# Altium schematic sheet Cell monitoring and balancing.SchDoc
size A4; Organization: Altium Limited; Address1: L3, 12a Rodborough Rd; Address2: Frenchs Forest; Address3: NSW; Address4: Australia 2086; SheetNumber: 3; SheetTotal: 5
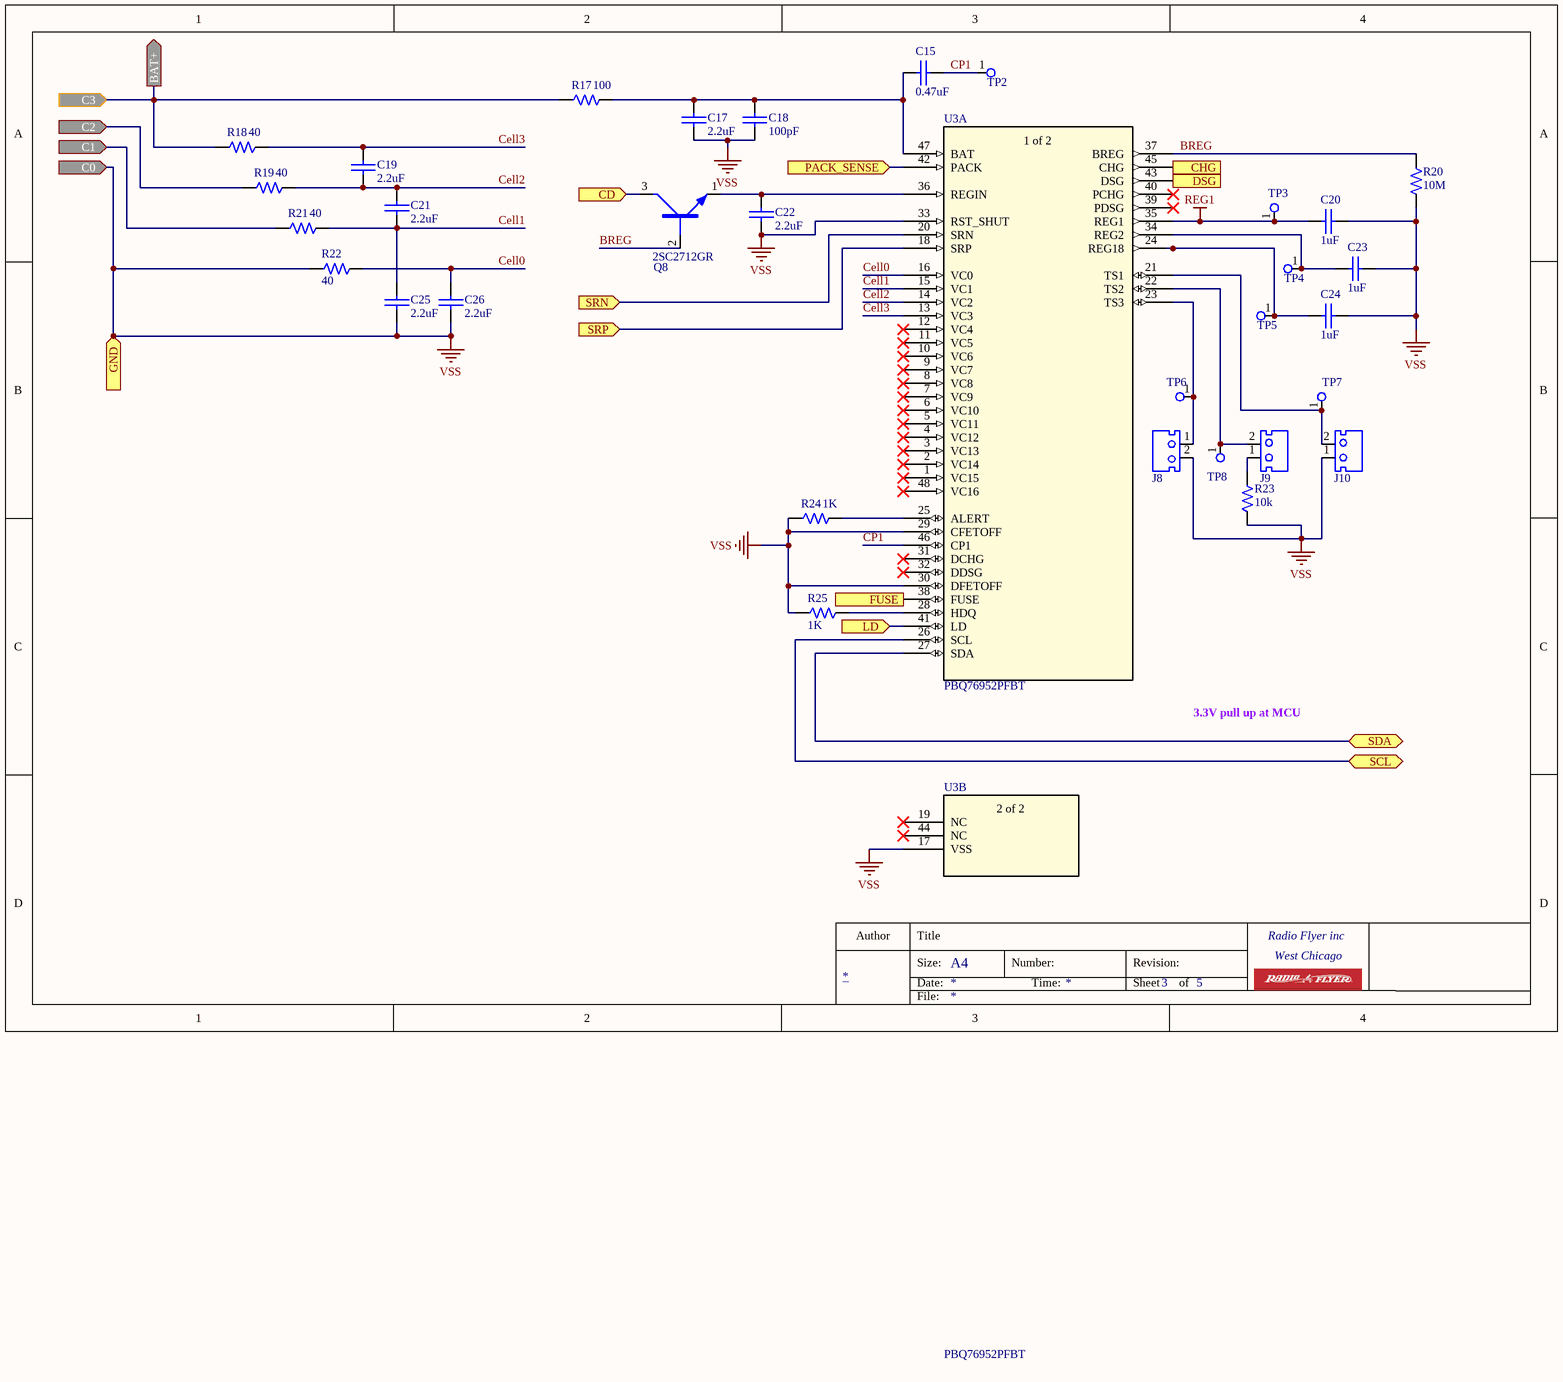
[diagram p0: Cell monitoring and balancing.SchDoc]

## Parts
C15  value 0.47uF  [CAPC0603-RW]  (hidden comment: T542021037308)
C17  value 2.2uF  [CAPC0603-RW]  (hidden comment: T542021037308)
C18  value 100pF  [CAPC0603-RW]  (hidden comment: T542021037308)
C19  value 2.2uF  [CAPC0603-RW]  (hidden comment: T542021037308)
C20  value 1uF  [CAPC0603-RW]  (hidden comment: T542021037308)
C21  value 2.2uF  [CAPC0603-RW]  (hidden comment: T542021037308)
C22  value 2.2uF  [CAPC0603-RW]  (hidden comment: T542021037308)
C23  value 1uF  [CAPC0603-RW]  (hidden comment: T542021037308)
C24  value 1uF  [CAPC0603-RW]  (hidden comment: T542021037308)
C25  value 2.2uF  [CAPC0603-RW]  (hidden comment: T542021037308)
C26  value 2.2uF  [CAPC0603-RW]  (hidden comment: T542021037308)
J8  CCN250002-0102  [CONN 2P PH=2.5mm HAA250A-2 RED]  (value not drawn)
J9  CCN250002-0102  [CONN 2P PH=2.5mm HAA250A-2 RED]  (value not drawn)
J10  CCN250002-0102  [CONN 2P PH=2.5mm HAA250A-2 RED]  (value not drawn)
Q8  T5810040804A0  [2SC2712GR]  (value not drawn)
R17  value 100  [0603-RW]  (hidden comment: T502976002399)
R18  value 40  [0603-RW]  (hidden comment: T502976002399)
R19  value 40  [0603-RW]  (hidden comment: T502976002399)
R20  value 10M  [0603-RW]  (hidden comment: T502976002399)
R21  value 40  [0603-RW]  (hidden comment: T502976002399)
R22  value 40  [0603-RW]  (hidden comment: T502976002399)
R23  value 10k  [0603-RW]  (hidden comment: T502976002399)
R24  value 1K  [0603-RW]  (hidden comment: T502976002399)
R25  value 1K  [0603-RW]  (hidden comment: T502976002399)
TP2  CP1  [RT-01T-1.0B]  (value not drawn)
TP3  CP1  [RT-01T-1.0B]  (value not drawn)
TP4  CP1  [RT-01T-1.0B]  (value not drawn)
TP5  CP1  [RT-01T-1.0B]  (value not drawn)
TP6  CP1  [RT-01T-1.0B]  (value not drawn)
TP7  CP1  [RT-01T-1.0B]  (value not drawn)
TP8  CP1  [RT-01T-1.0B]  (value not drawn)
U3  PBQ76952PFBT  [PFB48_TEX]  (parts A,B of 2)

## Ports
BAT+ (out), C0 (in), C1 (in), C2 (in), C3 (in), CD (in), CHG (out), DSG (out), FUSE (out), GND (in), LD (in), PACK_SENSE (in), SCL (bidir), SDA (bidir), SRN (in), SRP (in)

## Nets
REG1: C20.2 TP3.1 U3.35(REG1)
VSS: C17.1 C18.1 C20.1 C22.1 C23.1 C24.1 C25.1 C26.1 J8.2 J10.1 R20.2 R22.1 R23.2 R24.1 R25.1 U3.17(VSS) U3.29(CFETOFF) U3.30(DFETOFF) U3.33(RST_SHUT) ; port C0, port GND
BAT+: R17.1 R18.1 ; port BAT+, port C3
BREG: Q8.2(B) R20.1 U3.37(BREG)
C1: R21.1 ; port C1
C2: R19.1 ; port C2
CD: Q8.3(C) ; port CD
Cell0: C26.2 R22.2 U3.16(VC0)
Cell1: C21.1 C25.2 R21.2 U3.15(VC1)
Cell2: C19.1 C21.2 R19.2 U3.14(VC2)
Cell3: C19.2 R18.2 U3.13(VC3)
CHG: U3.45(CHG) ; port CHG
CP1: C15.1 TP2.1 U3.46(CP1)
DSG: U3.43(DSG) ; port DSG
FUSE: U3.38(FUSE) ; port FUSE
LD: U3.41(LD) ; port LD
PACK_SENSE: U3.42(PACK) ; port PACK_SENSE
SCL: U3.26(SCL) ; port SCL
SDA: U3.27(SDA) ; port SDA
SRN: U3.20(SRN) ; port SRN
SRP: U3.18(SRP) ; port SRP
NetC15_2: C15.2 C17.2 C18.2 R17.2 U3.47(BAT)
NetC22_2: C22.2 Q8.1(E) U3.36(REGIN)
NetC23_2: C23.2 TP4.1 U3.34(REG2)
NetC24_2: C24.2 TP5.1 U3.24(REG18)
NetJ8_1: J8.1 TP6.1 U3.23(TS3)
NetJ9_1: J9.1 R23.1
NetJ9_2: J9.2 TP8.1 U3.22(TS2)
NetJ10_2: J10.2 TP7.1 U3.21(TS1)
NetR24_2: R24.2 U3.25(ALERT)
NetR25_2: R25.2 U3.28(HDQ)

Not connected (* = marked no-connect by the designer): U3 1(VC15)* 2(VC14)* 3(VC13)* 4(VC12)* 5(VC11)* 6(VC10)* 7(VC9)* 8(VC8)* 9(VC7)* 10(VC6)* 11(VC5)* 12(VC4)* 19(NC)* 31(DCHG)* 32(DDSG)* 39(PDSG)* 40(PCHG)* 44(NC)* 48(VC16)*

## Notes on the sheet
- 3.3V pull up at MCU
- Author
- Title
- Size:
- Date:
- A4
- Number:
- Time:
- Revision:
- Sheet
- of
- Radio Flyer inc
- West Chicago
- File:
- (in symbol PBQ76952PFBT, part A) 1 of 2
- (in symbol PBQ76952PFBT, part B) 2 of 2

## Library data of the parts
C15 C17-C26 = CAP0603 0.01uF 16V 10%_X7R_WALSIN: CAP X7R .01UF 16V +-10% 0603 WALSIN L; Tolerance: 10%; Type: Capacitor; CREATE_NAME: Nathan; DIP&SMD: SMD; SAP: T542021037308; PACKAGE: CAPC0603; Vendor Name: *; MFG: WALSIN; MFG Part: *; Other: X7R; CREATE_TIME: 13-July-2016; Customer Specific: N/A; Voltage: 16V
J8-J10 = CONN 2P PH=2.5mm HAA250A-2 RED: CONNECTOR HA2.5 2PIN RED G; Value: 2.5mm; SAP: T690300024700; MFG: 金瑞康; CREATE_NAME: Nathan; Current: 3A; DIP&SMD: DIP; MFG Part: HAA250A-2 RED; Vendor Name: *; Vendor Code: *; Type: Connector; CREATE_TIME: 15-June-2016
Q8 = 2SC2712GR: NPN 50V 2SC2712GR SOT23 BLUE R K; MFG: BLUE ROCKET(藍箭電子); Current: 0.15A; CREATE_NAME: Nathan; DIP&SMD: SMD; SAP: T5810040804A0; Vendor Code: *; Vendor Name: *; Power: *; Voltage: 50V; Type: NPN; CREATE_TIME: 14-July-2017; Package: SOT23 (SC-59 SST3); Customer Specific: N/A; MFG Part: 2SC2712GR
R17-R25 = RES0603 1/10W +-1% 976 OHM 100PPM: CHIP 976 OHM 100PPM +-1% 0603 WALS L; Power: 0.1W; MFG: WALSIN; CREATE_NAME: Tom; DIP&SMD: SMD; Vendor Code: *; SAP: T502976002399; Vendor Name: *; MFG Part: *; Type: Resistor; CREATE_TIME: 17-Dec-2015; PACKAGE: 0603; TOL: +-1%; Customer Specific: N/A
TP2-TP8 = TERMINAL RT-01T-1.0B: TERMINAL 11MM G; CREATE_NAME: Nathan; SAP: T690300035900; MFG: 利民豐（JST); DIP&SMD: DIP; MFG Part: RT-01T-1.0B; Vendor Name: *; Vendor code: *; Type: *; Package: *; CREATE_TIME: 07-July-2016
U3 = PBQ76952PFBT: No Description Available; Mfr_Name: Texas Instruments; RefDes: RefDes; Type: Type